# EAGLE schematic 1-6 connector (EAGLE 9.6.2)
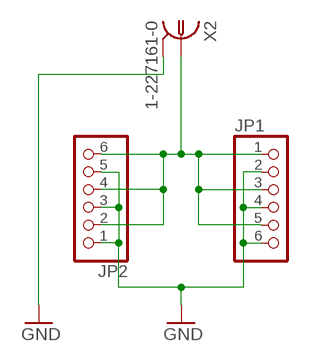
[diagram p0: schematic, sheet 1]

## Parts
JP1  PINHD-1X6  [1X06]
JP2  PINHD-1X6  [1X06]
X2  1-227161-0  [AMP_227161]

## Nets
GND: JP1.2 JP1.4 JP1.6 JP2.1 JP2.3 JP2.5 X2.2
N$3: JP1.1 JP1.3 JP1.5 JP2.2 JP2.4 JP2.6 X2.1

## Library data of the parts
JP1 JP2 = pinhead:PINHD-1X6: PIN HEADER
X2 = con-coax_xavi:?227161*: JACK, RIGHT ANGLE, 50 OHM, PCB, BNC Source: amp_227161.pdf; MF: TYCO ELECTRONICS; MPN: 1-227161; OC_FARNELL: unknown; OC_NEWARK: 33B3200